# EAGLE design m365_esp32 (EAGLE 9.1.3)
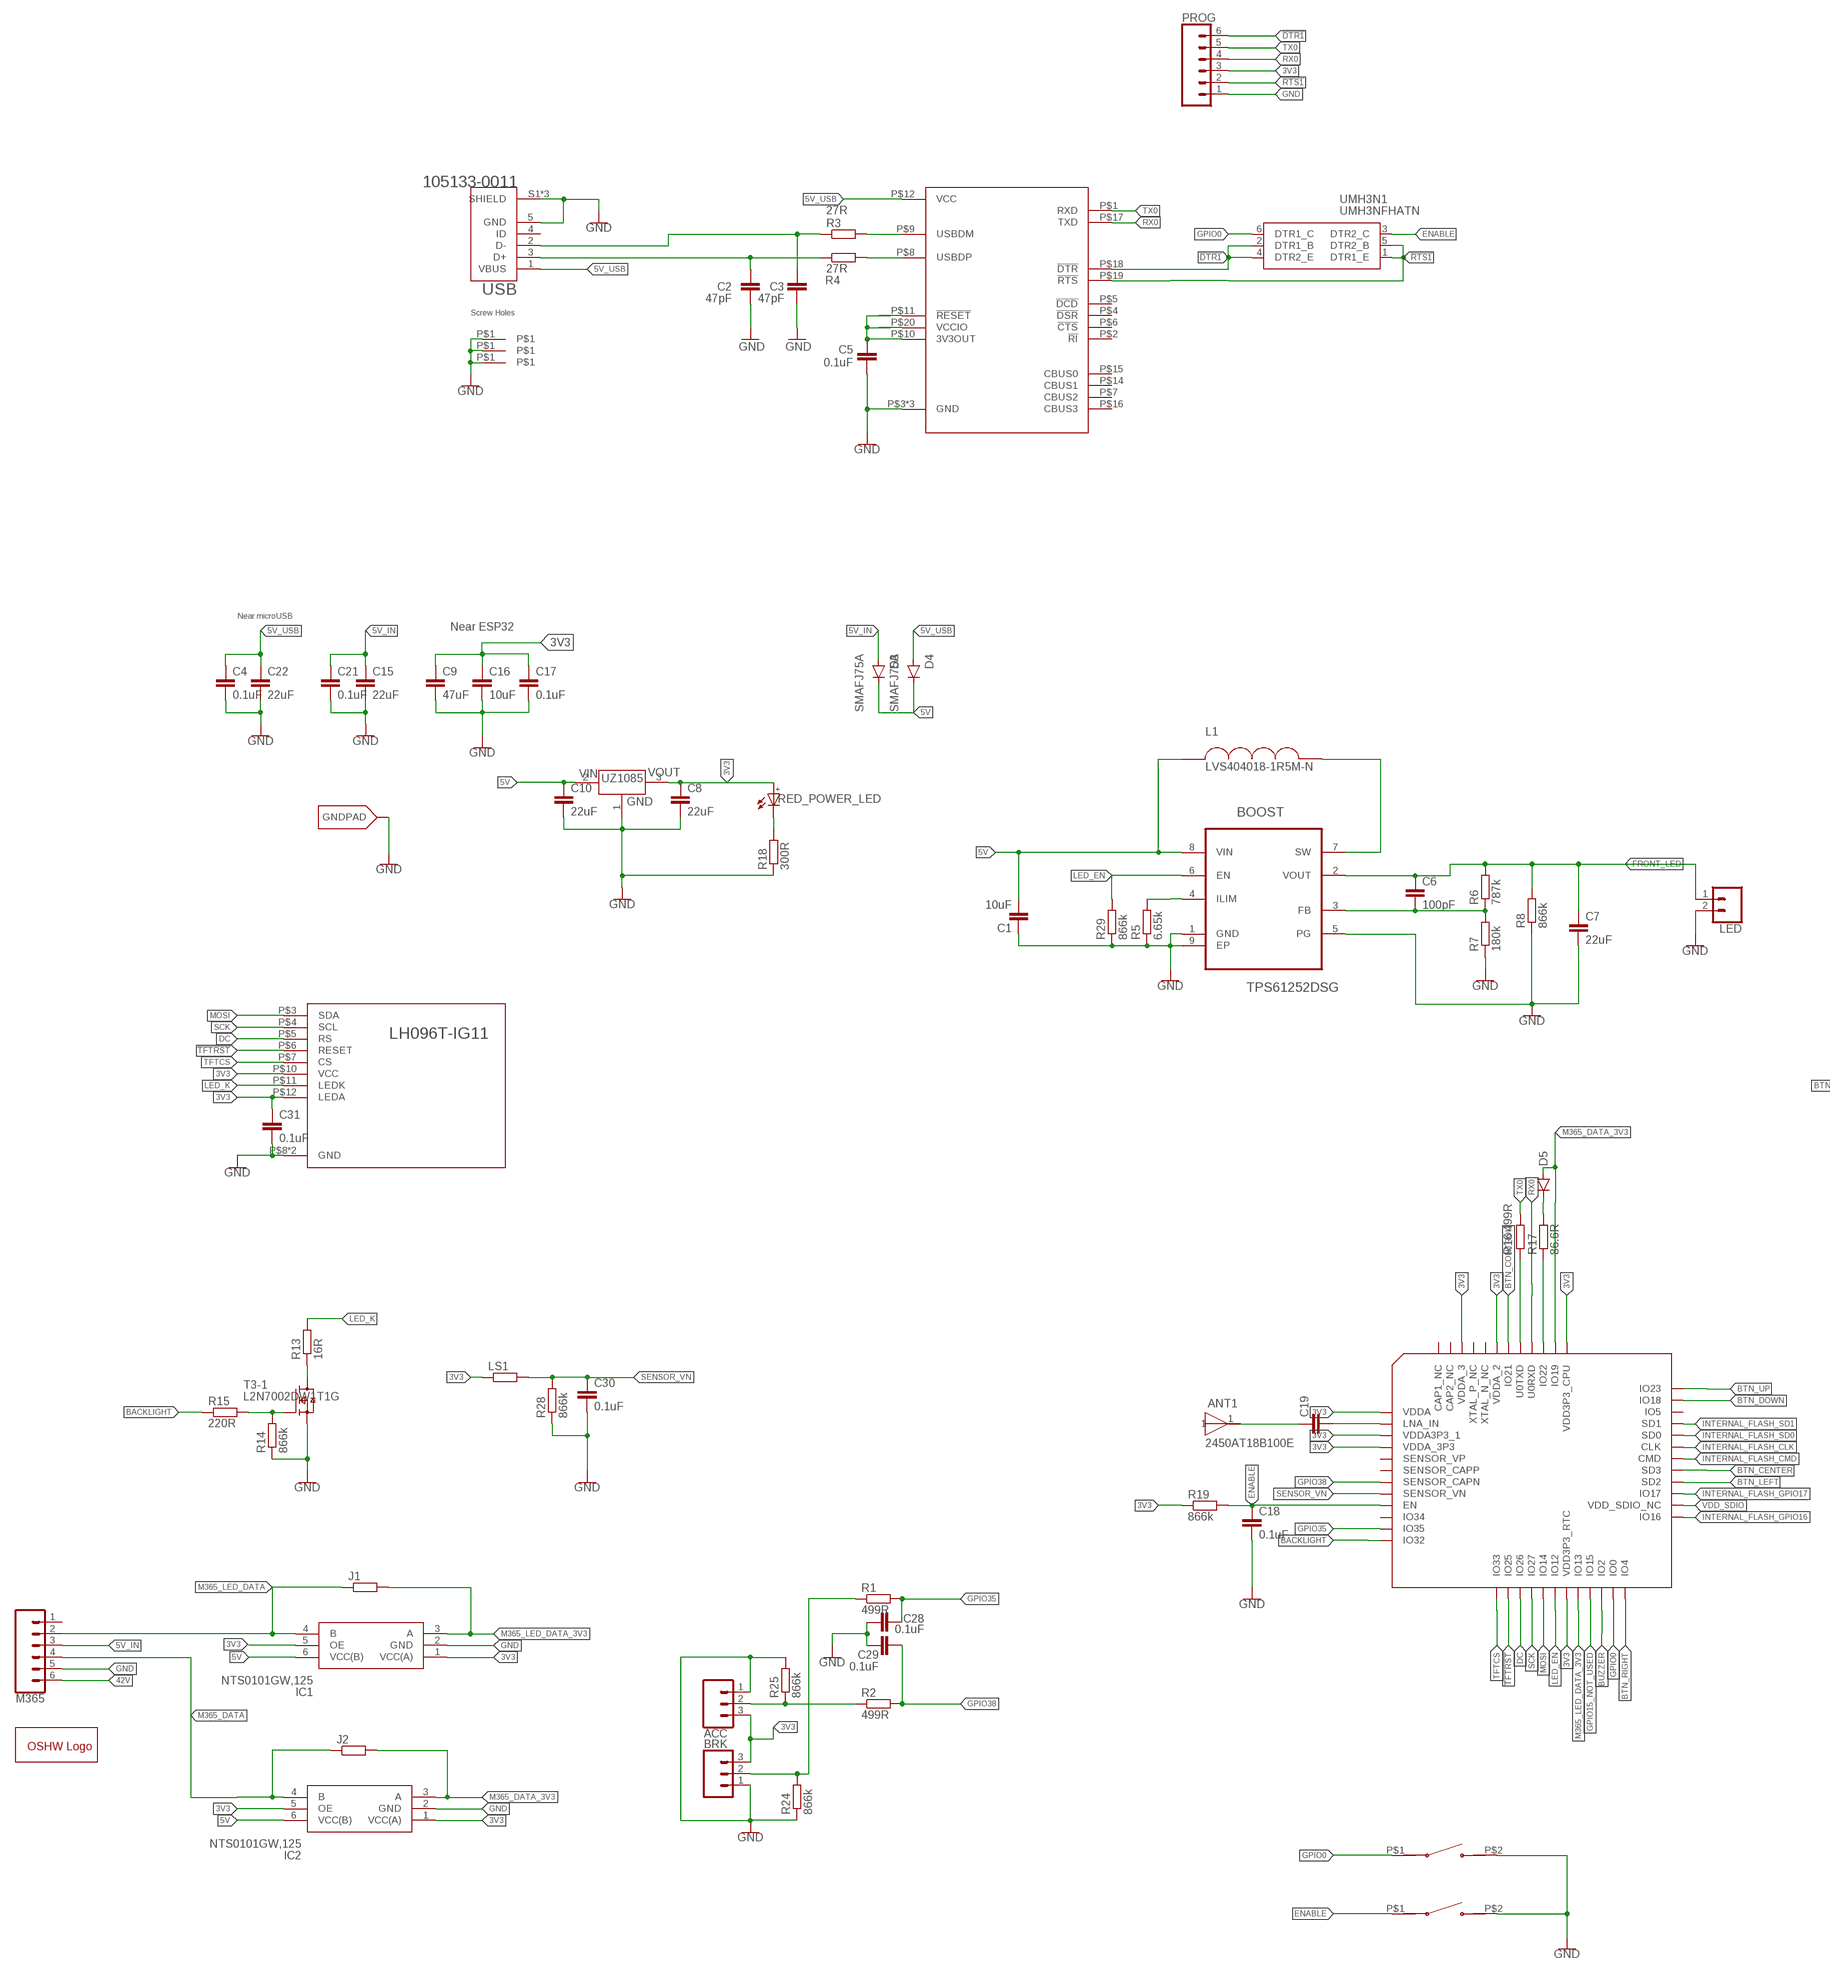
[diagram p0: schematic, sheet 1, part 1 of 2]
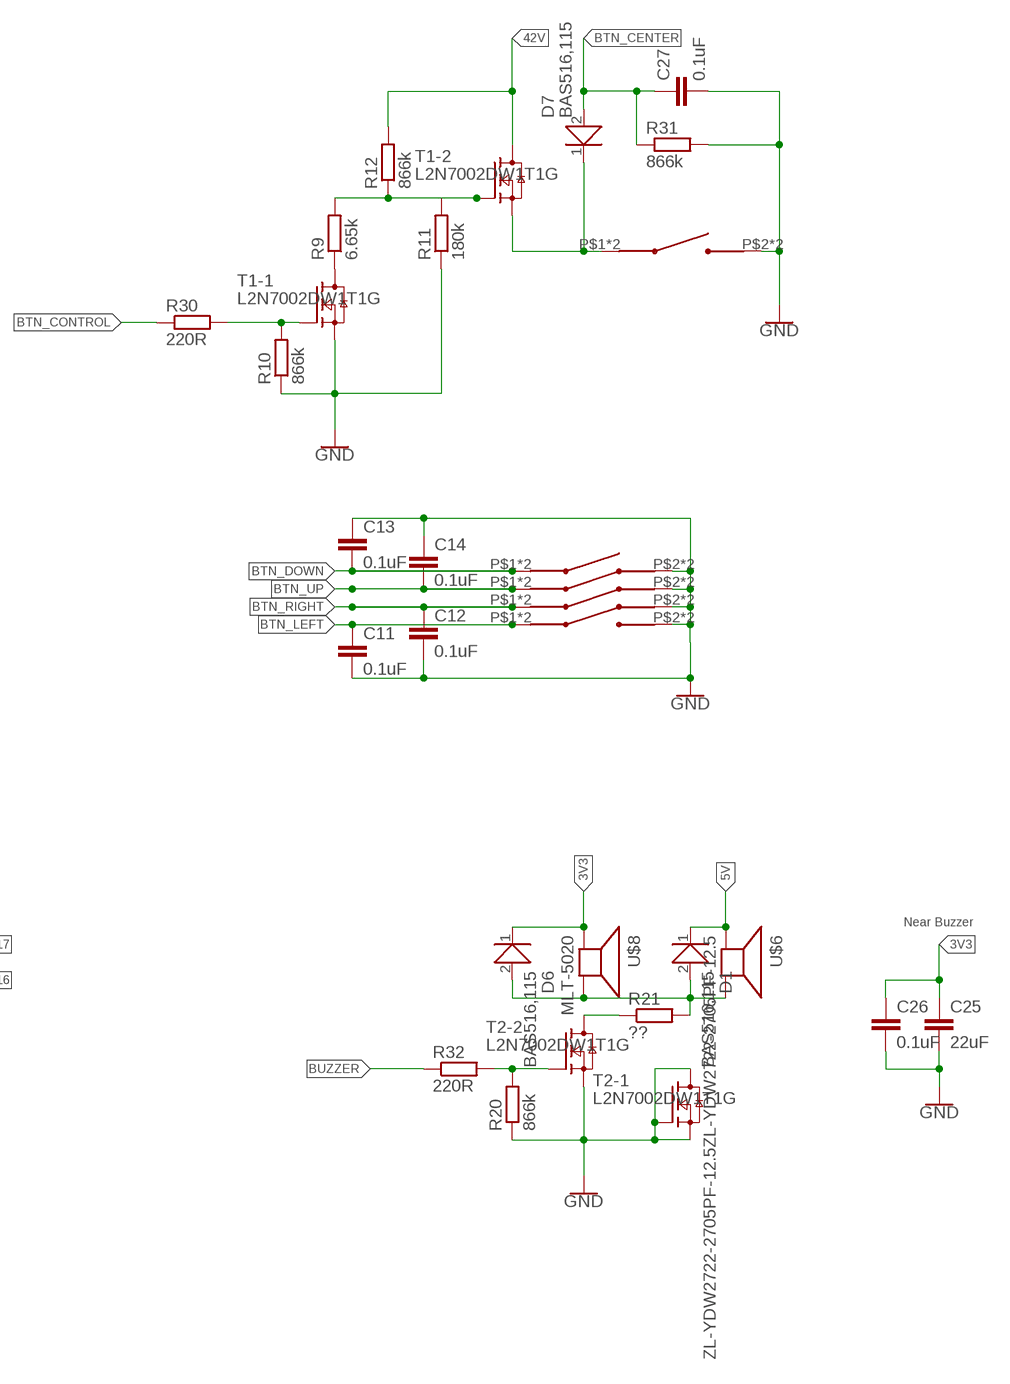
[diagram p1: schematic, sheet 1, part 2 of 2]

## Parts
ACC  CONN_03LONGPADS  [1X03_LONGPADS]
ANT1  2450AT18B100E  [ANT_2450AT18B100E]
BOOST  TPS61252DSG  [SON50P200X200X80-9N]
BRK  CONN_03LONGPADS  [1X03_LONGPADS]
C1  10uF  CC1206  [C1206]
C2  47pF  C-EUC0402  [C0402]
C3  47pF  C-EUC0402  [C0402]
C4  0.1uF  CC0402  [C0402]
C5  0.1uF  CC0402  [C0402]
C6  100pF  CC0603  [C0603]
C7  22uF  CC0603  [C0603]
C8  22uF  CC0603  [C0603]
C9  47uF  CC0603  [C0603]
C10  22uF  CC0603  [C0603]
C11  0.1uF  CC0402  [C0402]
C12  0.1uF  CC0402  [C0402]
C13  0.1uF  CC0402  [C0402]
C14  0.1uF  CC0402  [C0402]
C15  22uF  CC0603  [C0603]
C16  10uF  CC0402  [C0402]
C17  0.1uF  CC0402  [C0402]
C18  0.1uF  CC0402  [C0402]
C19  CC0402  [C0402]
C21  0.1uF  CC0402  [C0402]
C22  22uF  CC0603  [C0603]
C25  22uF  CC0603  [C0603]
C26  0.1uF  CC0402  [C0402]
C27  0.1uF  CC0402  [C0402]
C28  0.1uF  CC0402  [C0402]
C29  0.1uF  CC0402  [C0402]
C30  0.1uF  CC0402  [C0402]
C31  0.1uF  CC0402  [C0402]
CENTER  KSEK43J  [KSEK43J]
D1  BAS516,115  [SOD1608X65N]
D3  SMAFJ75A  [SMAFJ75A]
D4  SMAFJ75A  [SMAFJ75A]
D5  SMAFJ75A  [SMAFJ75A]
D6  BAS516,115  [SOD1608X65N]
D7  BAS516,115  [SOD1608X65N]
DOWN  KSEK43J  [KSEK43J]
FT231X  FT231XQ-R  [FT231XQ-R]
GOLD_ORB_SM2  OSHWLOGOLOGO5MM  [OSHW_5MM]
IC1  NTS0101GW,125  [SOT65P210X110-6N]
IC2  NTS0101GW,125  [SOT65P210X110-6N]
IC3  UNEXPECTEDMAKER_ESP32-PICO-D4  [UNEXPECTEDMAKER_PICO-D4-QFN48]
J1  RR0402  [R0402]
J2  RR0402  [R0402]
L1  LVS404018-1R5M-N  [LVS404018]
LED  CONN_02PTH3  [1X02_LONGPADS]
LEFT  KSEK43J  [KSEK43J]
LS1  RR1206  [R1206]
M365  CONN_06LONGPADS  [1X06_LONGPADS]
PROG  CONN_06LOCK  [1X06_LOCK]
R1  499R  RR0402  [R0402]
R2  499R  RR0402  [R0402]
R3  27R  R-EU_R0402  [R0402]
R4  27R  R-EU_R0402  [R0402]
R5  6.65k  RR0402  [R0402]
R6  787k  RR0603  [R0603]
R7  180k  RR0603  [R0603]
R8  866k  RR0402  [R0402]
R9  6.65k  RR0402  [R0402]
R10  866k  RR0402  [R0402]
R11  180k  RR0603  [R0603]
R12  866k  RR0402  [R0402]
R13  16R  RR0402  [R0402]
R14  866k  RR0402  [R0402]
R15  220R  RR0402  [R0402]
R16  499R  RR0402  [R0402]
R17  86.6R  RR0402  [R0402]
R18  300R  RR0402  [R0402]
R19  866k  RR0402  [R0402]
R20  866k  RR0402  [R0402]
R21  ??  R  [R0805]
R24  866k  RR0402  [R0402]
R25  866k  RR0402  [R0402]
R28  866k  RR0402  [R0402]
R29  866k  RR0402  [R0402]
R30  220R  RR0402  [R0402]
R31  866k  RR0402  [R0402]
R32  220R  RR0402  [R0402]
RED_POWER_LED  WL-SMCD_0603_150060BS55040  [WL-SMCD_0603]
REG  UZ1085L-33-TN3-R  [TO-252-2]
RIGHT  KSEK43J  [KSEK43J]
T1  L2N7002DW1T1G  2N7002PS  [SOT363]
T2  L2N7002DW1T1G  2N7002PS  [SOT363]
T3  L2N7002DW1T1G  2N7002PS  [SOT363]
U$1  TL3302BF260QJ  [TL3302BF260QJ]
U$2  TL3302BF260QJ  [TL3302BF260QJ]
U$3  SCREWHOLE-M2  [SCREWHOLE-M2]
U$4  SCREWHOLE-M2  [SCREWHOLE-M2]
U$5  SCREWHOLE-M2  [SCREWHOLE-M2]
U$6  ZL-YDW2722-2705PF-12.5ZL-YDW2722-2705PF-12.5  [ZL-YDW2722-2705PF-12.5]
U$8  MLT-5020  [MLT-5020]
U$11  LH096T-IG11  [LH096T-IG11]
UMH3N1  UMH3NFHATN  [SOT65P210X100-6N]
UP  KSEK43J  [KSEK43J]
USB  105133-0011  [MOLEX_105133-0011]

## Nets
3V3: ACC.3 BRK.3 C8.1 C9.1 C16.1 C17.1 C25.1 C26.1 C31.1 D6.1 IC1.1(VCC(A)) IC1.5(OE) IC2.1(VCC(A)) IC2.5(OE) IC3.1(VDDA) IC3.3(VDDA3P3_1) IC3.4(VDDA_3P3) IC3.19(VDD3P3_RTC) IC3.37(VDD3P3_CPU) IC3.43(VDDA_2) IC3.46(VDDA_3) LS1.1 PROG.3 R19.1 RED_POWER_LED.2(A) REG.3(VOUT) U$8.P$2(+) U$11.P$10(VCC) U$11.P$12(LEDA)
5V: BOOST.8(VIN) C1.2 C10.1 D1.1 D3.P$1(CATHODE) D4.P$1(CATHODE) IC1.6(VCC(B)) IC2.6(VCC(B)) L1.P$1 REG.2(VIN) U$6.P$1(+)
5V_IN: C15.1 C21.1 D3.P$2(ANODE) M365.3
5V_USB: C4.1 C22.1 D4.P$2(ANODE) FT231X.P$12(VCC) USB.1(VBUS)
42V: M365.6 R12.2 T1.3(-2:D)
!DTR1: FT231X.P$18(!DTR) PROG.6 UMH3N1.2(DTR1_B) UMH3N1.4(DTR2_E)
!RTS1: FT231X.P$19(!RTS) PROG.2 UMH3N1.1(DTR1_E) UMH3N1.5(DTR2_B)
!TFTRST: IC3.14(IO25) U$11.P$6(RESET)
A2: ACC.2 R2.1 R25.1
A5: BRK.2 R1.1 R24.2
BACKLIGHT: IC3.12(IO32) R15.1
BTN_CENTER: C27.1 D7.2 IC3.29(SD3) R31.1
BTN_CONTROL: IC3.42(IO21) R30.1
BTN_DOWN: C13.2 DOWN.P$1 DOWN.P$4 IC3.35(IO18)
BTN_LEFT: C11.1 IC3.28(SD2) LEFT.P$1 LEFT.P$4
BTN_RIGHT: C12.1 IC3.24(IO4) RIGHT.P$1 RIGHT.P$4
BTN_UP: C14.2 IC3.36(IO23) UP.P$1 UP.P$4
BUZZER: IC3.22(IO2) R32.1
DC: IC3.15(IO26) U$11.P$5(RS)
ENABLE: C18.1 IC3.9(EN) R19.2 U$2.P$1 UMH3N1.3(DTR2_C)
FRONT_LED: BOOST.2(VOUT) C6.1 C7.1 LED.1 R6.2 R8.2
GND: ACC.1 BOOST.1(GND) BOOST.5(PG) BOOST.9(EP) BRK.1 C1.1 C2.1 C3.1 C4.2 C5.2 C7.2 C8.2 C9.2 C10.2 C11.2 C12.2 C13.1 C14.1 C15.2 C16.2 C17.2 C18.2 C21.2 C22.2 C25.2 C26.2 C27.2 C28.1 C29.1 C30.2 C31.2 CENTER.P$2 CENTER.P$3 DOWN.P$2 DOWN.P$3 FT231X.P$3(GND) FT231X.P$13(GND) FT231X.P$21(GND) IC1.2(GND) IC2.2(GND) IC3.EXP(GNDPAD) LED.2 LEFT.P$2 LEFT.P$3 M365.5 PROG.1 R5.1 R7.1 R8.1 R10.1 R11.1 R14.1 R18.1 R20.1 R24.1 R25.2 R28.1 R29.1 R31.2 REG.1(GND) RIGHT.P$2 RIGHT.P$3 T1.1(-1:S) T2.1(-1:S) T2.2(-1:G) T2.4(-2:S) T2.6(-1:D) T3.1(-1:S) U$1.P$2 U$2.P$2 U$3.P$1 U$4.P$1 U$5.P$1 U$11.P$8(GND) U$11.P$13(GND) UP.P$2 UP.P$3 USB.5(GND) USB.S1(SHIELD) USB.S2(SHIELD) USB.S3(SHIELD)
GPIO0: IC3.23(IO0) U$1.P$1 UMH3N1.6(DTR1_C)
GPIO15_NOT_USED: IC3.21(IO15)
GPIO35: C28.2 IC3.11(IO35) R1.2
GPIO38: C29.2 IC3.7(SENSOR_CAPN) R2.2
INTERNAL_FLASH_CLK: IC3.31(CLK)
INTERNAL_FLASH_CMD: IC3.30(CMD)
INTERNAL_FLASH_GPIO16: IC3.25(IO16)
INTERNAL_FLASH_GPIO17: IC3.27(IO17)
INTERNAL_FLASH_SD0: IC3.32(SD0)
INTERNAL_FLASH_SD1: IC3.33(SD1)
LED_EN: BOOST.6(EN) IC3.18(IO12) R29.2
LED_K: R13.2 U$11.P$11(LEDK)
LNA_IN: C19.2 IC3.2(LNA_IN)
M365_DATA: IC2.4(B) J2.1 M365.4
M365_DATA_3V3: D5.P$2(ANODE) IC2.3(A) IC3.38(IO19) J2.2
M365_LED_DATA: IC1.4(B) J1.1 M365.2
M365_LED_DATA_3V3: IC1.3(A) IC3.20(IO13) J1.2
MOSI: IC3.17(IO14) U$11.P$3(SDA)
N$1: IC3.41(U0TXD) R16.1
N$2: ANT1.1 C19.1
N$3: R18.2 RED_POWER_LED.1(C)
N$4: CENTER.P$1 CENTER.P$4 D7.1 T1.4(-2:S)
N$5: R9.2 R11.2 R12.1 T1.5(-2:G)
N$6: C5.1 FT231X.P$10(3V3OUT) FT231X.P$11(!RESET) FT231X.P$20(VCCIO)
N$7: BOOST.7(SW) L1.P$2
N$8: BOOST.4(ILIM) R5.2
N$9: BOOST.3(FB) C6.2 R6.1 R7.2
N$10: R9.1 T1.6(-1:D)
N$11: D1.2 D6.2 R21.2 U$6.P$2(-) U$8.P$3(-)
N$12: R21.1 T2.3(-2:D)
N$13: R13.1 T3.6(-1:D)
N$14: R14.2 R15.2 T3.2(-1:G)
N$15: D5.P$1(CATHODE) R17.2
N$17: IC3.39(IO22) R17.1
N$28: R10.2 R30.2 T1.2(-1:G)
N$29: R20.2 R32.2 T2.5(-2:G)
RX0: FT231X.P$17(TXD) IC3.40(U0RXD) PROG.4
SCK: IC3.16(IO27) U$11.P$4(SCL)
SENSOR_VN: C30.1 IC3.8(SENSOR_VN) LS1.2 R28.2
TFTCS: IC3.13(IO33) U$11.P$7(CS)
TX0: FT231X.P$1(RXD) PROG.5 R16.2
USB-DATA_M: C3.2 R3.1 USB.2(D-)
USB-DATA_P: C2.2 R4.1 USB.3(D+)
USBDM: FT231X.P$9(USBDM) R3.2
USBDP: FT231X.P$8(USBDP) R4.2
VDD_SDIO: IC3.26(VDD_SDIO_NC)
Unconnected: FT231X.P$2(!RI) FT231X.P$4(!DSR) FT231X.P$5(!DCD) FT231X.P$6(!CTS) FT231X.P$7(CBUS2) FT231X.P$14(CBUS1) FT231X.P$15(CBUS0) FT231X.P$16(CBUS3) IC3.5(SENSOR_VP) IC3.6(SENSOR_CAPP) IC3.10(IO34) IC3.34(IO5) IC3.44(XTAL_N_NC) IC3.45(XTAL_P_NC) IC3.47(CAP2_NC) IC3.48(CAP1_NC) M365.1 T3.3(-2:D) T3.4(-2:S) T3.5(-2:G) USB.4(ID)

## Notes on the sheet
- Screw Holes
- Near microUSB
- Near ESP32
- Near Buzzer

## Library data of the parts
ACC BRK = SparkFun-Connectors:CONN_03: Multi connection point. Often used as Generic Header-pin footprint for 0.1 inch spaced/style header connections On any of the 0.1 inch spaced packages, you can populate with these: Break Away Headers - Straight <https://www.sparkfun.com/products/116> (PRT-00116) Break Away Male Headers - Right Angle <https://www.sparkfun.com/products/553> (PRT-00553) Female Headers <https://www.sparkfun.com/products/115> (PRT-00115) Break Away Headers - Machine Pin <https://www.sparkfun.com/products/117> (PRT-00117) Break Away Female Headers - Swiss Machine Pin <https://www.sparkfun.com/products/743> (PRT-00743) Stackable Header - 3 Pin (Female, 0.1") <https://www.sparkfun.com/products/13875> (PRT-13875) For SCREWTERMINALS and SPRING TERMINALS visit here: Screw Terimnals on SparkFun.com <https://www.sparkfun.com/search/results?term=Screw+Terminals> (5mm/3.5mm/2.54mm spacing) This device is also useful as a general connection point to wire up your design to another part of your project. Our various solder wires solder well into these plated through hole pads. Hook-Up Wire - Assortment (Stranded, 22 AWG) <https://www.sparkfun.com/products/11375> (PRT-11375) Hook-Up Wire - Assortment (Solid Core, 22 AWG) <https://www.sparkfun.com/products/11367> (PRT-11367) View the entire wire category on our website here <https://www.sparkfun.com/categories/141> Special notes: Molex polarized connector foot print use with SKU : PRT-08232 with associated crimp pins and housings.
ANT1 = 2450AT18B100E:2450AT18B100E: ANTENNA, CERAMIC, 2.45GHZ; Bandwidth: 100MHz; Frequency: 2.45GHz; Gain: -0.5dB; Impedance: 50ohm http://www.snapeda.com/parts/2450AT18B100E/Johanson/view-part/#; AVAILABILITY: Unavailable; DESCRIPTION: ANTENNA, CERAMIC, 2.45GHZ; Bandwidth: 100MHz; Frequency: 2.45GHz; Gain: -0.5dB; Impedance: 50ohm; MF: Johanson Technology; MP: 2450AT18B100E; PACKAGE: None; PRICE: None
BOOST = TPS61252DSG:TPS61252DSG: TINY 1.5-A BOOST CONVERTER WITH ADJUSTABLE INPUT CURRENT LIMIT; AVAILABILITY: Unavailable; DESCRIPTION: 3.5MHz, 1.5A, 92% Efficient Boost Converter with Adjustable Input Current Limit 8-WSON -40 to 85; MF: Texas Instruments; MP: TPS61252DSG; PACKAGE: None; PRICE: None
C1 C4-C19 C21 C22 C25-C31 = eagle-ltspice:C: CAPACITOR, European symbol; SPICEMODEL: NONE; SPICEPREFIX: C
C2 C3 = resistor:C-EU: CAPACITOR, European symbol
CENTER DOWN LEFT RIGHT UP = my-lib:KSEK43J
D1 D6 D7 = BAS516_115:BAS516,115: NXP - BAS516,115 - DIODE, SWITCHING, 150MA, 100V, SOD-523 Source: Datasheet <http://www.mouser.com/ds/2/302/BAS16_SER-839896.pdf>; DESCRIPTION: NXP - BAS516,115 - DIODE, SWITCHING, 150MA, 100V, SOD-523; HEIGHT: 0.65mm; MANUFACTURER_NAME: Nexperia; MANUFACTURER_PART_NUMBER: BAS516,115; MOUSER_PART_NUMBER: 771-BAS516-T/R; MOUSER_PRICE-STOCK: https://www.mouser.com/Search/Refine.aspx?Keyword=771-BAS516-T%2FR; RS_PART_NUMBER: 0508282; RS_PRICE-STOCK: http://uk.rs-online.com/web/p/products/0508282
D3-D5 = my-lib:SMAFJ75A
FT231X = FT231XQ-R:FT231XQ-R
GOLD_ORB_SM2 = oshw:OSHWLOGO: The OSHW logo for PCB layout
IC1 IC2 = NTS0101GW_125:NTS0101GW,125: NXP - NTS0101GW,125 - TRANSCEIVER, BIDIR TRANSLATOR, SC-88-6 Source: Datasheet <https://www.nxp.com/docs/en/data-sheet/NTS0101.pdf>; DESCRIPTION: NXP - NTS0101GW,125 - TRANSCEIVER, BIDIR TRANSLATOR, SC-88-6; HEIGHT: 1.1mm; MANUFACTURER_NAME: Nexperia; MANUFACTURER_PART_NUMBER: NTS0101GW,125; MOUSER_PART_NUMBER: 771-NTS0101GW125; MOUSER_PRICE-STOCK: https://www.mouser.com/Search/Refine.aspx?Keyword=771-NTS0101GW125
IC3 = m365_esp32:UNEXPECTEDMAKER_ESP32-PICO-D4
J1 J2 LS1 R1 R2 R5-R21 R24 R25 R28-R32 = eagle-ltspice:R: RESISTOR, European symbol; SPICEMODEL: NONE; SPICEPREFIX: R
L1 = my-lib:LVS404018-1R5M-N
LED = SparkFun-Connectors:CONN_02: Multi connection point. Often used as Generic Header-pin footprint for 0.1 inch spaced/style header connections On any of the 0.1 inch spaced packages, you can populate with these: Break Away Headers - Straight <https://www.sparkfun.com/products/116> (PRT-00116) Break Away Male Headers - Right Angle <https://www.sparkfun.com/products/553> (PRT-00553) Female Headers <https://www.sparkfun.com/products/115> (PRT-00115) Break Away Headers - Machine Pin <https://www.sparkfun.com/products/117> (PRT-00117) Break Away Female Headers - Swiss Machine Pin <https://www.sparkfun.com/products/743> (PRT-00743) For SCREWTERMINALS and SPRING TERMINALS visit here: Screw Terimnals on SparkFun.com <https://www.sparkfun.com/search/results?term=Screw+Terminals> (5mm/3.5mm/2.54mm spacing) This device is also useful as a general connection point to wire up your design to another part of your project. Our various solder wires solder well into these plated through hole pads. Hook-Up Wire - Assortment (Stranded, 22 AWG) <https://www.sparkfun.com/products/11375> (PRT-11375) Hook-Up Wire - Assortment (Solid Core, 22 AWG) <https://www.sparkfun.com/products/11367> (PRT-11367) View the entire wire category on our website here <https://www.sparkfun.com/categories/141> Special notes: Molex polarized connector foot print use with: PRT-08233 with associated crimp pins and housings. 2.54_SCREWTERM for use with PRT-10571. 3.5mm Screw Terminal footprints for PRT-08084 5mm Screw Terminal footprints for use with PRT-08432
M365 PROG = SparkFun-Connectors:CONN_06: Multi connection point. Often used as Generic Header-pin footprint for 0.1 inch spaced/style header connections On any of the 0.1 inch spaced packages, you can populate with these: Break Away Headers - Straight <https://www.sparkfun.com/products/116> (PRT-00116) Break Away Male Headers - Right Angle <https://www.sparkfun.com/products/553> (PRT-00553) Female Headers <https://www.sparkfun.com/products/115> (PRT-00115) Break Away Headers - Machine Pin <https://www.sparkfun.com/products/117> (PRT-00117) Break Away Female Headers - Swiss Machine Pin <https://www.sparkfun.com/products/743> (PRT-00743) Arduino Stackable Header - 6 Pin <https://www.sparkfun.com/products/9280> (PRT-09280) For SCREWTERMINALS and SPRING TERMINALS visit here: Screw Terimnals on SparkFun.com <https://www.sparkfun.com/search/results?term=Screw+Terminals> (5mm/3.5mm/2.54mm spacing) This device is also useful as a general connection point to wire up your design to another part of your project. Our various solder wires solder well into these plated through hole pads. Hook-Up Wire - Assortment (Stranded, 22 AWG) <https://www.sparkfun.com/products/11375> (PRT-11375) Hook-Up Wire - Assortment (Solid Core, 22 AWG) <https://www.sparkfun.com/products/11367> (PRT-11367) View the entire wire category on our website here <https://www.sparkfun.com/categories/141>
R3 R4 = resistor:R-EU_: RESISTOR, European symbol
RED_POWER_LED = Wurth_Elektronik_Optoelectronics_rev18a:WL-SMCD_0603: WL-SMCD SMD Mono-color Chip LED Diffused Characteristics Industrial 0603 platform – 1.6 x 0.8 mm Wide viewing angle 140° Thin version: 0.4 mm Applications Office Automation Home appliances Industrial equipment Front panel backlighting Button backlighting LCD backlighting Navigation backlighting <http://katalog.we-online.de/media/images/v2/Family_WL-SMCD_0603_thin_0,4mm_150060xx55040.jpg> Details see: http://katalog.we-online.de/en/led/WL-SMCD?m Created By Yingchun Shan 2018-03-09 2018 (C) Wurth Elektronik
REG = my-lib:UZ1085L-33-TN3-R
T1-T3 = nxp_60_1_1:2N7002P: 60 V, 320 mA N-channel Trench MOSFET Dual N-channel enhancement mode Field-Effect Transistor (FET) in a very small SOT363 (SC-88) Surface-Mounted Device (SMD) plastic package using Trench MOSFET technology. AAL Eindhoven MK
U$1 U$2 = my-lib:TL3302BF260QJ
U$3-U$5 = my-lib:SCREWHOLE-M2
U$6 = my-lib:ZL-YDW2722-2705PF-12.5
U$8 = my-lib:MLT-5020
U$11 = my-lib:LH096T-IG11
UMH3N1 = UMH3NFHATN:UMH3NFHATN: ROHM - UMH3NFHATN - TRANS, NPN, AUTO, 4.7K/4.7K, SOT-353 Source: Datasheet <http://www.rohm.com/web/global/datasheet/UMH3NFHA/umh3nfha-e>; DESCRIPTION: ROHM - UMH3NFHATN - TRANS, NPN, AUTO, 4.7K/4.7K, SOT-353; HEIGHT: 1mm; MANUFACTURER_NAME: ROHM Semiconductor; MANUFACTURER_PART_NUMBER: UMH3NFHATN; MOUSER_PART_NUMBER: 755-UMH3NFHATN; MOUSER_PRICE-STOCK: https://www.mouser.com/Search/Refine.aspx?Keyword=755-UMH3NFHATN
USB = 105133-0011:105133-0011: Conn Micro USB Type B RCP 5 POS 0.65mm Solder ST SMD 5 Terminal 1 Port Embossed T/R; AVAILABILITY: Unavailable; DESCRIPTION: Conn Micro USB Type B RCP 5 POS 0.65mm Solder ST SMD 5 Terminal 1 Port Embossed T/R; MF: Molex; MP: 105133-0011; PACKAGE: None; PRICE: None

## Board
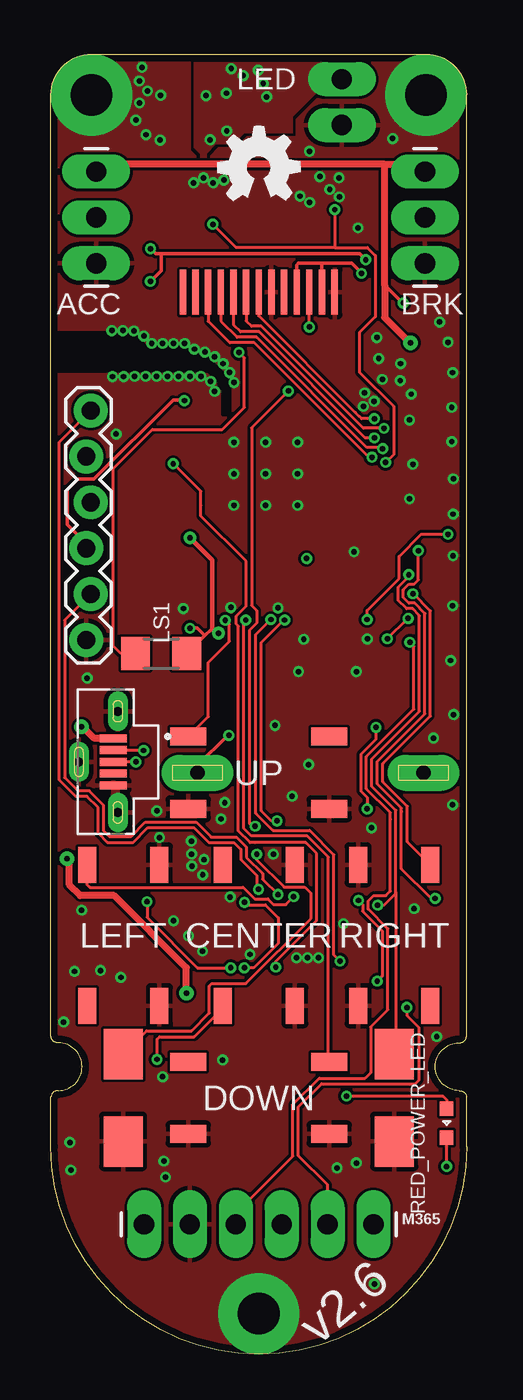
[diagram p2: board, top side]
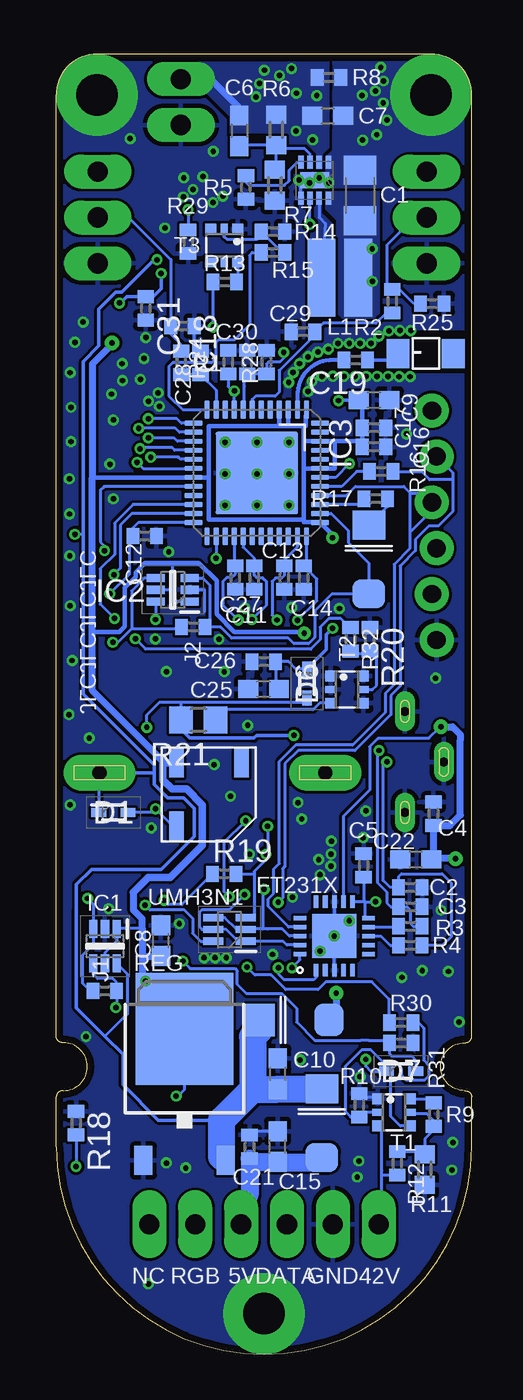
[diagram p3: board, bottom side, seen from below]

Size 23 x 71.98 mm. Coordinates in mm from the lower left corner, seen from the top.
Outline: 23,11.5 arc-180 0,11.5 0,14.25 arc-90 0.4,14.6 arc180 0.4,17.25 arc-90 0,17.6 0,69.73 arc-90 2.25,71.98 20.75,71.98 arc-90 23,69.73 23,17.6 arc-90 22.6,17.25 arc180 22.6,14.6 arc-90 23,14.25 23,11.5
Copper layers (1*16): Top 0.035559375mm / dielectric 1.6mm / Bottom 0.035559375mm
Design rules "oshpark-2layer": minimum track width 6mil, minimum drill 10mil, track to track 6mil, track to pad 6mil, pad to pad 6mil, via to via 6mil, smd to smd 6mil, copper to edge 15mil, drill to drill 6mil, minimum pad ring 5mil, minimum via ring 5mil, stop-mask expansion 2.5mil, vias tented up to drill 0mil, thermal gap 10mil

### Footprints (pad centres in the part's own frame; a part is rotated, then mirrored left to right if it is on the bottom)
1X03_LONGPADS = drill 1.118 pad 1.88 long: 1 0,0; 2 2.54,0; 3 5.08,0
ANT_2450AT18B100E = smd 1.27 x 1.6: 1 -1.535,0; 2 1.535,0
SON50P200X200X80-9N = smd 0.711 x 0.305: 1 -0.991,0.762; 2 -0.991,0.254; 3 -0.991,-0.254; 4 -0.991,-0.762; 5 0.991,-0.762; 6 0.991,-0.254; 7 0.991,0.254; 8 0.991,0.762 | smd 0.889 x 1.6: 9 0,0
C1206 = smd 1.6 x 1.8: 1 -1.4,0; 2 1.4,0
C0402 = smd 0.7 x 0.9: 1 -0.65,0; 2 0.65,0
C0603 = smd 1.1 x 1: 1 -0.85,0; 2 0.85,0
KSEK43J = smd 2 x 1: P$1 3.9,2; P$2 3.9,-2; P$3 -3.9,-2; P$4 -3.9,2
SOD1608X65N = smd 0.818 x 0.5: 1 -0.808,0; 2 0.808,0
SMAFJ75A = smd 1.6 x 1.8: P$1 1.9,0; P$2 -1.9,0
FT231XQ-R = smd 0.7 x 0.25: P$1 -1.9,1; P$2 -1.9,0.5; P$3 -1.9,0; P$4 -1.9,-0.5; P$5 -1.9,-1; P$11 1.9,-1; P$12 1.9,-0.5; P$13 1.9,0; P$14 1.9,0.5; P$15 1.9,1 | smd 0.25 x 0.7: P$6 -1,-1.9; P$7 -0.5,-1.9; P$8 0,-1.9; P$9 0.5,-1.9; P$10 1,-1.9; P$16 1,1.9; P$17 0.5,1.9; P$18 0,1.9; P$19 -0.5,1.9; P$20 -1,1.9 | smd 2.45 x 2.45: P$21 0,0
SOT65P210X110-6N = smd 1 x 0.45: 1 -0.95,0.65; 2 -0.95,0; 3 -0.95,-0.65; 4 0.95,-0.65; 5 0.95,0; 6 0.95,0.65
UNEXPECTEDMAKER_PICO-D4-QFN48 = smd 1.016 x 0.3: 1 -3.505,2.75; 2 -3.505,2.25; 3 -3.505,1.75; 4 -3.505,1.25; 5 -3.505,0.75; 6 -3.505,0.25; 7 -3.505,-0.25; 8 -3.505,-0.75; 9 -3.505,-1.25; 10 -3.505,-1.75; 11 -3.505,-2.25; 12 -3.505,-2.75; 25 3.505,-2.75; 26 3.505,-2.25; 27 3.505,-1.75; 28 3.505,-1.25; 29 3.505,-0.75; 30 3.505,-0.25; 31 3.505,0.25; 32 3.505,0.75; 33 3.505,1.25; 34 3.505,1.75; 35 3.505,2.25; 36 3.505,2.75 | smd 0.3 x 1.016: 13 -2.75,-3.505; 14 -2.25,-3.505; 15 -1.75,-3.505; 16 -1.25,-3.505; 17 -0.75,-3.505; 18 -0.25,-3.505; 19 0.25,-3.505; 20 0.75,-3.505; 21 1.25,-3.505; 22 1.75,-3.505; 23 2.25,-3.505; 24 2.75,-3.505; 37 2.75,3.505; 38 2.25,3.505; 39 1.75,3.505; 40 1.25,3.505; 41 0.75,3.505; 42 0.25,3.505; 43 -0.25,3.505; 44 -0.75,3.505; 45 -1.25,3.505; 46 -1.75,3.505; 47 -2.25,3.505; 48 -2.75,3.505 | smd 4.572 x 4.572: EXP 0,0
R0402 = smd 0.7 x 0.9: 1 -0.65,0; 2 0.65,0
LVS404018 = smd 4.318 x 1.524: P$1 0,1.016; P$2 0,-1.016
1X02_LONGPADS = drill 1.118 pad 1.88 long: 1 0,0; 2 2.54,0
R1206 = smd 1.6 x 1.803: 1 -1.422,0; 2 1.422,0
1X06_LONGPADS = drill 1.118 pad 1.88 long: 1 0,0; 2 2.54,0; 3 5.08,0; 4 7.62,0; 5 10.16,0; 6 12.7,0
1X06_LOCK = drill 1.016 pad 1.88: 1 0,0; 2 2.54,-0.254; 3 5.08,0; 4 7.62,-0.254; 5 10.16,0; 6 12.7,-0.254
R0603 = smd 1 x 1.1: 1 -0.85,0; 2 0.85,0
R0805 = smd 1.3 x 1.5: 1 -0.95,0; 2 0.95,0
WL-SMCD_0603 = smd 0.8 x 0.75: 1 -0.8,0; 2 0.8,0
TO-252-2 = smd 1 x 1.6: 1 -2.28,-6.07; 2 2.28,-6.07 | smd 5.4 x 6.2: 3 0,1.23
SOT363 = smd 0.6 x 0.6: 1 -0.75,-0.9; 3 0.75,-0.9; 4 0.75,0.9; 6 -0.75,0.9 | smd 0.4 x 0.6: 2 0,-0.9; 5 0,0.9
TL3302BF260QJ = smd 2.795 x 2.16: P$1 -2.413,0; P$2 2.413,0
SCREWHOLE-M2 = drill 2.3 pad 4.5: P$1 0,0
ZL-YDW2722-2705PF-12.5 = drill 0.8 pad 2 long: P$1 -6.25,0; P$2 6.25,0
MLT-5020 = smd 0.8 x 1.6: P$1 -1.8,-1.75; P$2 1.8,-1.75; P$3 1.8,1.75
LH096T-IG11 = smd 0.35 x 2.5: P$1 -4.2,0; P$2 -3.5,0; P$3 -2.8,0; P$4 -2.1,0; P$5 -1.4,0; P$6 -0.7,0; P$7 0,0; P$8 0.7,0; P$9 1.4,0; P$10 2.1,0; P$11 2.8,0; P$12 3.5,0; P$13 4.2,0
SOT65P210X100-6N = smd 1.1 x 0.4: 1 -0.9,0.65; 2 -0.9,0; 3 -0.9,-0.65; 4 0.9,-0.65; 5 0.9,0; 6 0.9,0.65
MOLEX_105133-0011 = smd 0.45 x 1.5: 1 -1.3,-0.25; 2 -0.65,-0.25; 3 0,-0.25; 4 0.65,-0.25; 5 1.3,-0.25 | drill 0.5 pad 1.1 long: S1 -2.8,0; S2 2.8,0; S3 0,-2.15

### Placement (x,y rotation side)
ACC  2.5,60.4 90 top
ANT1  2.55,55.4 0 bottom
BOOST  8.7,65 270 bottom
BRK  20.7,60.4 90 top
C1  6.19,64.16 270 bottom
C2  3.4,25.85 180 bottom
C3  3.4,24.78 180 bottom
C4  2.12,29.93 90 bottom
C5  5.99,27.07 90 bottom
C6  12.87,67.74 270 bottom
C7  7.97,68.57 0 bottom
C8  17.2,22.9 90 bottom
C9  5.41,52.83 0 bottom
C10  10.73,15.53 90 bottom
C11  13.1,43 270 bottom
C12  18.1,45.3 0 bottom
C13  10.38,43 90 bottom
C14  9.3,43 90 bottom
C15  10.75,11.5 90 bottom
C16  5.41,50.24 0 bottom
C17  5.41,51.3 0 bottom
C18  13.48,54.93 90 bottom
C19  6.43,55.05 180 bottom
C21  12.3,11.49 90 bottom
C22  3.1,27.4 180 bottom
C25  11.52,36.83 180 bottom
C26  11.51,38.35 180 bottom
C27  12.04,43 270 bottom
C28  15.02,54.89 270 bottom
C29  9.34,56.61 0 bottom
C30  12.42,54.93 90 bottom
C31  18.04,57.91 270 bottom
CENTER  11.5,23.2 90 top
D1  19.83,30 0 bottom
D3  8.3,12.8 90 bottom
D4  9.81,18.51 180 bottom
D5  5.7,44 90 bottom
D6  9.12,37.14 270 bottom
D7  3.91,15.68 0 bottom
DOWN  11.5,14.2 0 top
FT231X  7.61,23.16 90 bottom
GOLD_ORB_SM2  11.5,65.7 0 top
IC1  20.3,22.6 270 bottom
IC2  16.55,42.33 180 bottom
IC3  11.9,48.8 270 bottom
J1  20.31,20.12 180 bottom
J2  15.41,40.27 0 bottom
L1  7.3,59.6 270 bottom
LED  16.1,70.6 270 top
LEFT  4,23.2 90 top
LS1  6.1,38.8 180 top
M365  17.85,7.2 180 top
PROG  1.95,39.55 90 top
R1  16.08,54.89 270 bottom
R2  4.4,58.3 270 bottom
R3  3.4,23.7 180 bottom
R4  3.4,22.64 180 bottom
R5  12.5,64.6 90 bottom
R6  10.82,67.79 90 bottom
R7  10.9,64.73 90 bottom
R8  7.9,70.69 180 bottom
R9  2.1,13.27 270 bottom
R10  6.23,13.79 270 bottom
R11  2.6,10.23 90 bottom
R12  4.12,10.57 270 bottom
R13  13.68,59.37 180 bottom
R14  11,62.15 180 bottom
R15  11,61 0 bottom
R16  5.01,48.88 0 bottom
R17  5.32,47.37 0 bottom
R18  21.9,12.8 270 bottom
R19  13.7,26.6 0 bottom
R20  5.64,39.59 270 bottom
R21  15.13,35.12 180 bottom
R24  16.01,56.93 180 bottom
R25  2.19,58.17 0 bottom
R28  11.36,54.94 270 bottom
R29  15.7,61.6 90 bottom
R30  3.91,18.37 0 bottom
R31  3.9,17.24 0 bottom
R32  6.71,39.59 270 bottom
RED_POWER_LED  21.9,12.8 90 top
REG  15.9,16.8 0 bottom
RIGHT  19,23.2 270 top
T1  4.3,13.4 270 bottom
T2  6.9,36.8 270 bottom
T3  13.7,61.4 180 bottom
U$1  19,14.2 270 top
U$2  4,14.2 270 top
U$3  11.5,2.25 0 top
U$4  20.75,69.73 0 top
U$5  2.25,69.73 0 top
U$6  14.36,32.19 180 top
U$8  14.55,31 180 bottom
U$11  11.5,58.8 0 top
UMH3N1  13.41,23.52 180 bottom
UP  11.5,32.2 0 top
USB  3.7,32.8 270 top

### Tracks (layer width: path | path; a pad name or v marks a point on that pad's centre or on a via)
3V3  (via drill 0.3 pad 0.6, 0.3 pad 0.7, 0.3 pad 0.8)
  Top 0.152: 19.47,58.2 v19.5,58.2 | RED_POWER_LED.2 21.9,14.1 21.7,14.3 v16.36,14.3 | LS1.1 7.52,38.82 | 9.01,40.14 8.93,40.14 8.86,40.14 | v17.02,25.13 17.25,24.91 17.25,24.52 18.34,23.43 18.34,20.94 v18.06,20.66
  Top 0.2: U$11.P$10 13.6,60.3 13.7,60.4 15.01,60.4 | 15.01,60.4 16.64,60.4 v17.19,59.85 | U$11.P$12 15,60.39 15.01,60.4 | 18.47,59.2 19.47,58.2 | PROG.3 1.95,44.89 0.9,45.94 0.9,47.87 1.48,48.45 2.37,48.45 6.76,52.83 7.35,52.83 v7.38,52.8 | LS1.1 8.51,39.79 | 8.51,39.79 8.86,40.14 | v7.7,40.2 8.1,40.2 8.51,39.79
  Top 0.25: 9.01,40.14 9.22,39.93 v9.27,39.93 | 8.93,40.14 8.93,43.97 v7.7,45.2
  Top 0.4: ACC.3 2.9,65.88 18.47,65.88 | BRK.3 20.3,65.88 18.47,65.88 | 18.47,65.88 18.47,59.2 18.47,57.4 19.87,56 v19.9,56
  Bottom 0.152: REG.3 15.61,18.03 14,19.64 | 16.59,17.09 16.59,16.88 18.38,15.09 | REG.3 16.9,18.03 | IC1.5 20.3,22.23 19.66,22.88 19.66,23.3 19.65,23.31 IC1.1 19.6,23.6 18.25,23.6 | 10.72,39.98 10.7,40 | IC2.1 16.55,41.68 16.55,42.33 | 16.55,42.33 16.55,43.8 | IC2.5 16.55,42.33 | C25.1 10.86,37.02 C26.1 10.14,38.35 9.74,37.95 D6.1 | R19.1 16.05,24.91 16.8,24.91 v17.02,25.13 | REG.3 15.9,18.5 v18.06,20.66 | v16.36,14.3 16.25,14.3 15.9,14.65 REG.3
  Bottom 0.2: v17.19,59.85 17.19,58.99 17.62,58.56 C31.1 19.1,58.56 19.46,58.2 v19.5,58.2 | v7.38,52.8 7.35,52.83 C9.1 | D6.1 8.06,39.01 8.06,39.84 v7.7,40.2
  Bottom 0.25: 10.72,40 9.34,40 v9.27,39.93 | 10.7,40 13.14,40 14.13,40.99 14.13,42.83 15.1,43.8 16.55,43.8 18.1,43.8 18.61,43.29 18.61,43.03 19.19,42.45 19.19,40.31 19.5,40 21,40 | 21,48.55 IC3.19 14.56,48.55 | IC3.4 10.65,51.4 | IC3.1 9.15,51.98 9.18,51.98 9.18,51.4 9.3,51.4 | 10.65,51.4 10.15,51.4 | 10.15,51.4 9.3,51.4 | IC3.3 10.15,51.4 | 9.3,50.55 IC3.46 7.59,50.55 | 9.3,50.55 9.3,51.4 | 9.29,49.05 9.3,49.05 9.3,50.55 | 9.29,46.21 9.29,46.08 8.43,46.08 IC3.37 7.7,45.35 v7.7,45.2 | 9.29,46.21 9.29,49.05 | 10.65,51.4 14.56,51.4 14.56,48.55 | C9.1 6.06,52.83 C17.1 C16.1 6.06,50.55 7.59,50.55 | 7.59,50.55 7.59,49.05 IC3.43 9.29,49.05 | 9.29,46.21 14.56,46.21 14.56,48.55
  Bottom 0.4: 16.9,18.03 17.7,18.03 | 17.7,18.03 18.35,18.03 | 17.3,16.38 16.59,17.09 15.9,17.78 REG.3 17.07,19.2 17.1,19.2 18.25,20.35 18.25,22 | 18.05,18.38 17.7,18.03 | v19.9,56 19.9,55.93 21,54.83 21,48.55 21,40 21,36.74 17.31,33.05 | 18.25,22 18.25,23.6 18.25,24.12 18.73,24.6 18.73,25.57 | C8.1 17.25,22 18.25,22
  Bottom 0.406: 18.73,25.57 17.9,26.4 16.7,26.4 14.92,28.18 14.92,30.42 15.79,31.29 16.59,31.29 17.1,31.8 17.1,32.84 | 17.31,33.05 17.1,32.84 | U$8.P$2 17.01,32.75 17.1,32.84
5V  (via drill 0.3 pad 0.6)
  Top 0.152: v17.5,40.68 17.5,41.19 19.27,42.96 19.27,44.18 20.49,45.4 v21.97,45.4
  Top 0.2: v17.42,60.6 17.09,60.93 6.1,60.93 | 6.1,60.93 5.79,60.93 v5.51,61.21 | 6.1,60.93 6.1,60 v5.5,59.4
  Bottom 0.152: IC1.6 19.06,21.06 19.06,18.84 20.3,17.6 | 21.88,24.68 21.88,24.64 | IC2.6 v17.5,40.68 | v21.97,45.4 21.5,45.4 | D1.1 20.61,30.03 U$6.P$1
  Bottom 0.2: v17.42,60.6 17.57,60.6 19.37,58.8 19.7,58.8 20.64,57.86 20.64,55.84 21.5,54.97 21.5,45.4 21.5,36.56 17.57,32.63 17.57,32.2 17.57,31.54 16.83,30.8 15.94,30.8 15.37,30.23 15.37,28.67 17.19,26.86 21.04,26.86 21.88,26.02 21.88,24.68 | 13.85,12.97 17.34,12.97 19.3,14.92 19.3,16.59 20.3,17.6 21.88,19.18 21.88,24.64 | L1.P$1 6.28,60.44
  Bottom 0.203: 17.57,32.2 17.58,32.19 U$6.P$1
  Bottom 1: 13.85,10.96 REG.2
  Bottom 1.5: 13.85,10.96 13.85,12.97 12.13,14.68 | D3.P$1 8.32,14.68 C10.1 12.13,14.68 | 12.13,14.68 12.13,17.59 11.72,18 D4.P$1
  pour Bottom (no thermals): 5.1,64.4 8.1,64.4 8.1,63.6 8.1,63.4 7.5,62.8 7.5,60.2 7.5,57.67 7.13,57.3 5.41,57.3 5.1,57.61
5V_IN
  Bottom 1: D3.P$2 8.57,10.63 10.73,10.63 C15.1 12.11,10.65 C21.1 12.3,8.83 12.77,8.36 M365.3
5V_USB  (via drill 0.3 pad 0.8)
  Top 0.4: USB.1 2.4,34.1 1.76,34.74 v1.7,34.74 | v7.5,20 7.5,21.4 3.5,25.4 1.61,25.4 1.02,25.99 1.02,27.33 v0.9,27.45
  Bottom 0.152: v1.7,34.74 1.76,34.74 2.38,34.12 5.19,34.12 5.66,33.65 5.66,31.23 7.11,29.78 FT231X.P$12
  Bottom 0.4: D4.P$2 7.46,18.96 7.54,18.96 7.5,19 v7.5,20 | v0.9,27.45 2.2,27.45 C22.1 2.12,27.53 C4.1 1.21,29.28 0.63,29.86 0.63,34.02 0.63,34.31 1.06,34.74 v1.7,34.74
42V
  Bottom 0.152: 4.98,10.18 4.98,7.37 M365.6 | 4.98,10.18 4.98,12.43 T1.3 | R12.2 4.98,9.92 4.98,10.18
!DTR1  (via drill 0.3 pad 0.6)
  Top 0.152: PROG.6 0.46,50.5 0.46,31.81 1.37,30.89 1.99,30.89 2.62,30.27 2.62,28.85 3.12,28.34 4.56,28.34 5.37,29.16 7.91,29.16 8.73,28.34 10.12,28.34 10.51,27.95 10.51,27.39 11.39,26.5 11.39,25.84 v11.49,25.74
  Bottom 0.152: FT231X.P$18 10.1,23.16 10.48,23.54 11.3,23.54 11.58,23.54 | 11.58,23.54 11.58,25.65 v11.49,25.74 | 11.58,23.54 12.53,23.54 UMH3N1.2 13.02,23.52 13.67,24.17 UMH3N1.4
!RTS1  (via drill 0.3 pad 0.6)
  Top 0.152: PROG.2 0.76,40.65 0.76,31.94 1.5,31.2 2.12,31.2 2.92,30.4 2.92,28.98 3.23,28.67 4.43,28.67 5.22,29.46 8.04,29.46 8.86,28.64 10.26,28.64 10.81,28.09 10.81,27.52 11.72,26.61 11.72,26.3 v12.57,25.45
  Bottom 0.152: UMH3N1.1 | UMH3N1.1 12.94,22.87 13.58,23.52 UMH3N1.5 14.93,23.52 15.09,23.68 15.09,24.46 14.96,24.6 13.42,24.6 v12.57,25.45 | FT231X.P$19 10.23,22.66 10.44,22.87 UMH3N1.1
!TFTRST  (via drill 0.3 pad 0.6)
  Top 0.152: U$11.P$6 10.8,57.21 11.1,56.91 11.65,56.91 17.29,51.27 v18.43,51.27
  Bottom 0.152: IC3.14 16.18,51.05 16.4,51.27 v18.43,51.27
A2
  Bottom 0.152: ACC.2 3.16,62.94 4.7,61.4 4.7,59.2 4.45,58.95 R2.1 3.99,58.95 3.21,58.17 R25.1
A5
  Bottom 0.152: R1.1 16.08,55.89 16.66,56.47 R24.2 16.66,60.61 18.99,62.94 BRK.2
BACKLIGHT
  Bottom 0.152: R15.1 12.15,61 12.3,60.85 12.3,57 13.14,56.16 14.03,56.16 14.16,56.02 14.16,55.14 14.4,54.9 16.54,54.9 16.76,54.69 16.76,54.66 16.76,53.06 16,52.3 IC3.12
BTN_CENTER  (via drill 0.3 pad 0.6)
  Top 0.152: v15.99,21.77 15.66,22.1 15.66,27.66 14.31,29 12.29,29 11.35,29.95 11.35,39.86 v12.17,40.68
  Bottom 0.152: 12.04,43.47 C27.1 | v15.99,21.77 15.58,21.36 13.1,21.36 13.1,21.35 12.97,21.23 12.97,20.47 12.47,19.97 10.5,19.97 9.7,19.17 9.7,18.4 8.68,17.38 6.15,17.38 5.69,17.38 4.69,17.38 R31.1 4.55,16.64 4.43,16.52 3.33,16.52 3.1,16.29 D7.2 | C27.1 | IC3.29 12.65,44.69 12.04,44.08 C27.1 | v12.17,40.68 11.36,41.49 11.36,42.79 11.55,42.99 11.9,42.99 12.04,43.13 C27.1 | 12.04,43.39 C27.1
BTN_CONTROL  (via drill 0.3 pad 0.6)
  Top 0.152: v12.44,21.43 12.44,21.75 14.7,24.01 14.7,27.72 14.1,28.33 11.3,28.33 11.02,28.33 10.38,28.97 10.38,40.31 10.25,40.44 10.25,40.87 10.79,41.42 10.79,43.91 8.3,46.4 8.3,47 8.3,47.78 v6.77,49.31
  Bottom 0.152: R30.1 4.56,19.66 5.53,20.63 8.07,20.63 8.5,20.2 10.3,20.2 11.1,21 12.01,21 v12.44,21.43 | v6.77,49.31 7.53,48.55 IC3.42
BTN_DOWN  (via drill 0.3 pad 0.6)
  Top 0.152: DOWN.P$1 15.3,16.2 15.36,16.25 15.36,27.53 14.18,28.7 11.09,28.7 10.68,29.11 10.68,40.56 v10.78,40.65
  Bottom 0.152: v10.78,40.65 v10.79,40.65 11.05,40.92 11.05,42.8 10.86,42.99 10.51,42.99 10.38,43.12 C13.2 10.38,43.98 9.65,44.7 IC3.35
BTN_LEFT  (via drill 0.3 pad 0.6)
  Top 0.152: LEFT.P$1 2,26 2.15,25.85 10.63,25.85 11.27,25.21 12,25.21 12.31,24.91 13,24.91 v13.43,25.34 | v12.93,40.65 12.89,40.65 11.65,39.41 11.65,30.08 12.2,29.54 v12.51,29.54
  Bottom 0.152: v12.51,29.54 13.69,28.35 13.69,25.6 v13.43,25.34 | IC3.28 13.15,43.7 C11.1 13.1,43.2 13.3,43 13.57,43 13.77,42.8 13.77,41.5 v12.93,40.65
BTN_RIGHT  (via drill 0.3 pad 0.6)
  Top 0.152: v20.03,42.11 20.05,42.11 21,41.16 21,35.34 18.37,32.71 18.37,31.69 19.72,30.34 19.72,28.38 RIGHT.P$4
  Bottom 0.152: IC3.24 18.45,46.05 18.75,45.75 C12.1 18.96,45.09 18.96,43.18 v20.03,42.11
BTN_UP  (via drill 0.3 pad 0.6)
  Top 0.152: UP.P$4 8.71,35.31 8.71,38.31 9.87,39.48 9.87,40.42 v9.65,40.64
  Bottom 0.152: C14.2 9.4,43.75 9.4,43.82 | C14.2 | C14.2 9.18,43.52 | 9.18,43.52 8.58,42.93 8.58,41.71 v9.65,40.64 | IC3.36 9.15,43.55 9.18,43.52
BUZZER  (via drill 0.3 pad 0.6)
  Top 0.152: v18.62,39.62 19.74,40.74 v19.77,40.74
  Bottom 0.152: v19.77,40.74 20.57,41.53 20.57,43.5 19.77,44.29 19.77,46.02 18.74,47.05 IC3.22 | R32.1 6.76,40.24 7.25,40.73 7.92,40.73 8.39,40.26 8.39,39.56 8.91,39.05 18.05,39.05 v18.62,39.62
DC  (via drill 0.3 pad 0.6)
  Top 0.152: U$11.P$5 10.1,57 10.49,56.61 11.52,56.61 17.39,50.74 v17.89,50.74 v17.9,50.74
  Bottom 0.152: IC3.15 16.29,50.55 16.47,50.73 17.89,50.73 v17.9,50.74
ENABLE  (via drill 0.3 pad 0.6)
  Top 0.152: U$2.P$1 5.3,17.91 7.78,17.91 8.77,18.9 8.77,20.39 8.9,20.53 10.79,20.53 14.4,24.14 14.4,25.51 14.04,25.87 12.9,25.87 11.39,27.38 v11.39,27.69 | v13.14,53.34 11.1,51.3 11.1,41.46 11.38,41.18 11.38,40.48 11,40.1 11,29.38 11.14,29.24 v11.3,29.24
  Bottom 0.152: 12.04,26.6 12.04,24.24 12.11,24.17 UMH3N1.3 | IC3.9 13.15,53.18 13.12,53.22 13.15,53.25 13.19,53.29 | 13.19,53.29 v13.14,53.34 | C18.1 13.48,53.58 13.19,53.29 | R19.2 12.04,26.6 | v11.3,29.24 11.3,27.78 v11.39,27.69 11.39,27.38 12.04,26.73 12.04,26.6
FRONT_LED  (via drill 0.3 pad 0.6)
  Bottom 0.4: LED.1 14.45,70.6 12.87,69.02 C6.1
  other vias: 8.81,67.24 9.73,67.73 9.71,69.82 9.98,71.18 11.48,71.09 11.94,69.62 10.64,70.79 11.75,70.35 8.58,69.69
  pour Bottom (no thermals): 8.3,65.6 8.26,65.64 8.26,66.35 8.26,66.44 7.9,66.8 7.9,70.4 7.9,71.6 9.3,71.6 13.5,71.6 15.12,71.6 15.1,70.24 13.39,68.53 13.39,67.6 10.7,67.6 10.1,67 9.13,67 8.61,66.48 8.61,65.89 8.61,65.6
  pour Top (no thermals): 8.3,65.6 8.26,65.64 8.26,66.35 8.26,66.44 7.9,66.8 7.9,70.4 7.9,71.6 9.3,71.6 13.5,71.6 15.12,71.6 15.1,70.24 13.39,68.53 13.39,67.6 10.7,67.6 10.1,67 9.13,67 8.61,66.48 8.61,65.89 8.61,65.6
GND  (via drill 0.3 pad 0.6)
  Bottom 0.152: R10.1 6.01,14.22 5.27,14.22 T1.1 | BOOST.5 9.46,64.59 9.51,64.64 9.51,64.95 v9.57,65.01 | C15.2 12.09,12.35 C21.2 | FT231X.P$3 FT231X.P$21 FT231X.P$13 | R24.1 15.36,55.75 15.15,55.54 C28.1 | IC2.2 14.81,42.33 14.79,42.31 14.79,41.1
  other vias: 7.9,64.86 10.13,53.8 4.63,54.14 5.24,54.14 5.85,54.14 6.46,54.14 7.07,54.14 7.69,54.15 9.89,54.36 9.53,54.85 9.06,55.23 8.52,55.49 7.94,55.65 7.4,55.97 6.78,55.97 6.18,55.97 5.58,55.97 5.14,56.38 3.98,56.68 4.59,56.66 4.02,54.13 3.41,54.13 19.35,54.85 9.5,16.3 8.44,65.14 8.98,64.86 8.3,54.14 18.34,53.98 13.78,64.12 15.43,64.49 15.94,65.14 22.27,48.47 22.26,46.52 19.84,51.73 5.26,67.52 6.04,67.22 4.7,68.33 5.34,69.94 6.07,69.7 4.89,70.5 5.04,71.25 4.9,69.28 14.88,65.2 15.96,64.08 21.97,56.03 2,37.44 15.83,10.32 18.91,67.31 14.31,66.6 16.9,10.6 14.32,63.77 9.06,53.31 8.84,53.87 13.65,47 11.88,47 10.12,47 10.12,48.75 10.12,50.5 11.88,50.5 13.65,50.5 13.65,48.75 11.88,48.75 7.61,23.16 8.39,22.32 6.78,24 6.01,28.61 1.7,24.59 20.1,24.67 16.19,23.84 5.86,30.09 6.18,15.37 7.79,27.7 3.87,20.87 3.61,50.95 16.99,62.36 21.51,57.15 18.04,56.29 19.84,47.36 20.03,49.28 22.23,30.42 22.29,35.42 22.12,38.41 22.23,41.44 22.25,44.21 22.18,50.53 22.18,52.43 22.23,54.35 12.57,41.32 21.35,17.59 2.74,21.25 1.1,10.2 1.05,11.73 6.25,10.7 9.96,41.35 16.77,44.43 7.33,41.29 17.51,39.61 13.99,39.59 12.31,27.69 17.9,3.9 16.9,37.8 13.7,37.8 21.17,34.12 17.74,29.15 13.35,30.9 14.26,32.65 17.36,53.23 17.89,52.77 17.29,52.48 18.14,55.13 19.33,53.91 19.94,53.16 9.41,29.64 9.62,30.55 7.77,28.42 7.8,27.03 8.47,27.39 8.4,26.55 9.92,25.32 11.02,22.14 14.81,21.95 14.2,21.95 13.59,21.95 1.3,21.2 0.7,18.4 6.34,9.81 12.4,34.82 3.37,56.68
  pour Top (rank 5): -3.5,-2 -3.5,75 15.31,74.93 26.5,75 26.5,-2
  pour Bottom (rank 4, no thermals): 6.1,71.4 7.7,71.4 7.7,68.8 7.7,66.8 8.1,66.4 8.1,65.6 8.3,65.4 8.3,65 8.3,64.8 8.01,64.51 7.21,64.51 4.9,64.51 4.9,71.4
  pour Bottom (rank 5): -3.3,-2 -3.3,75 15.31,74.93 26.5,75 26.5,-2
GPIO0  (via drill 0.3 pad 0.6)
  Top 0.152: v19.8,43.17 19.8,43.06 19.2,42.45 19.2,41.77 19.69,41.28 20.01,41.28 20.39,40.9 20.39,35.59 17.76,32.96 17.76,31.44 19.09,30.11 19.09,25.6 19.09,25.52 | v18.08,24.87 18.44,24.87 19.09,25.52 | 19.09,25.52 19.09,16.7 U$1.P$1
  Bottom 0.152: UMH3N1.6 15,22.86 15.44,23.31 15.44,24.14 15.9,24.6 17.81,24.6 v18.08,24.87 | IC3.23 18.81,46.55 19.45,45.91 19.45,43.52 v19.8,43.17
GPIO35
  Bottom 0.152: IC3.11 14.15,53.37 C28.2 R1.2
GPIO38
  Bottom 0.152: R2.2 4.74,57.65 5.3,57.09 8.21,57.09 C29.2 8.69,56.44 10.66,54.47 10.66,53.27 10.88,53.05 11.96,53.05 12.15,52.86 IC3.7
LED_EN  (via drill 0.3 pad 0.6)
  Top 0.152: 15.71,61.27 v15.71,63.37 15.71,63.08 | v8.96,62.56 10.25,61.27 15.71,61.27 | 15.71,61.27 17.52,61.27 17.95,60.84 17.95,57.45 17.07,56.57 17.07,54.38 18.96,52.49 18.96,49.81 18.54,49.39 v18.52,49.39
  Bottom 0.152: v8.96,62.56 v8.95,62.57 BOOST.6 | v15.71,63.37 v15.7,63.37 R29.2 | v18.52,49.39 18.18,49.05 IC3.18
LED_K  (via drill 0.3 pad 0.6)
  Top 0.152: v14.3,56.87 U$11.P$11
  Bottom 0.152: R13.2 14.33,56.9 v14.3,56.87
LNA_IN
  Bottom 0.23: IC3.2 9.65,53.12 arc90 7.72,55.05 C19.2
M365_DATA  (via drill 0.3 pad 0.6)
  Top 0.152: M365.4 10.23,7.8 13.39,10.96 13.39,13.83 14.86,15.29 17.38,15.29 17.69,15.6 17.69,18.12 18.64,19.08 18.64,23.56 17.55,24.65 17.55,25.09 17.86,25.4 18.54,25.4 18.78,25.65 18.78,29.6 | v19.86,39.42 20.09,39.2 20.09,35.72 17.46,33.09 17.46,31.31 18.78,29.99 18.78,29.6 | 18.78,29.6 18.78,29.62
  Bottom 0.152: IC2.4 18.12,42.98 18.83,42.27 18.83,40.17 18.85,40.15 | 18.85,40.15 19.57,39.42 v19.86,39.42 | J2.1 16.18,40.15 18.85,40.15
M365_DATA_3V3
  Bottom 0.152: IC3.38 7.78,46.55 6.83,45.6 6.83,44.93 5.7,43.8 D5.P$2 7.75,42.1 8.69,41.16 8.69,39.69 | 8.69,39.69 | 8.69,39.69 9.03,39.35 9.85,39.35 10.15,39.65 13.29,39.65 13.9,40.26 14.49,40.26 | 14.49,40.26 14.7,40.26 14.71,40.27 J2.2 | IC2.3 14.88,42.98 14.49,42.59 14.49,40.26
M365_LED_DATA  (via drill 0.3 pad 0.6)
  Top 0.152: v19.7,19.2 19.7,18.76 20.38,18.08 20.38,15.19 20.18,14.99 14.98,14.99 13.7,13.7 13.7,11 15.31,9.39 M365.2
  Bottom 0.152: IC1.4 20.95,21.04 20.71,20.8 19.88,20.8 19.66,20.58 J1.1 19.66,19.24 v19.7,19.2
M365_LED_DATA_3V3  (via drill 0.3 pad 0.6)
  Top 0.152: 20.7,41.03 20.7,41 | v21.26,25.24 21.04,25.24 19.39,26.89 19.39,30 | 20.7,41.03 20.7,41 | 20.7,41.03 20.14,41.58 19.81,41.58 19.5,41.89 19.5,42.33 19.81,42.64 20.1,42.64 20.33,42.87 v20.33,44.49 | 19.39,30 19.39,30.07 | 19.39,30 19.39,30.24 18.07,31.57 18.07,32.84 20.7,35.46 20.7,41
  Bottom 0.152: J1.2 21.12,20.12 21.55,20.55 21.55,22.09 20.95,22.7 IC1.3 20.95,24.93 v21.26,25.24 | IC3.20 20.35,48.05 20.55,47.85 20.55,44.98 20.33,44.76 v20.33,44.49
MOSI  (via drill 0.3 pad 0.6)
  Top 0.152: U$11.P$3 8.7,57.2 9.9,56 11.26,56 17.59,49.68 v17.76,49.68 v17.77,49.67
  Bottom 0.152: v17.77,49.67 17.76,49.68 16.23,49.68 16.11,49.55 IC3.17
N$1
  Bottom 0.152: IC3.41 7.2,48.05 6.37,48.88 R16.1
N$2
  Bottom 0.2: ANT1.1 4.15,55.05 C19.1
N$3  (via drill 0.3 pad 0.6)
  Top 0.152: v21.9,10.4 RED_POWER_LED.1
  Bottom 0.152: R18.2 v21.9,10.4
N$4  (via drill 0.3 pad 0.6)
  Top 0.152: CENTER.P$4 9.5,19.16 7.92,17.58 6.01,17.58 5.87,17.44 v5.87,16.33
  Bottom 0.152: T1.4 3.95,12.65 4.49,13.19 4.49,15.45 D7.1 5.59,15.68 5.87,15.96 v5.87,16.33
N$5
  Bottom 0.152: T1.5 3.32,13.32 2.49,13.32 2.1,12.93 R9.2 2.1,12.42 2.6,11.92 R11.2 | R11.2 2.74,11.22 | R11.2 2.74,11.22 | 2.74,11.22 R12.1
N$6  (via drill 0.3 pad 0.6)
  Top 0.152: v9.95,21.4 8.11,21.4 5.32,24.19 v5.32,25.06
  Bottom 0.152: v9.95,21.4 9.51,21.84 FT231X.P$20 | 6.58,25.09 FT231X.P$11 6.3,25.06 5.99,25.06 | C5.1 5.99,25.06 | FT231X.P$10 5.89,24.16 5.89,25.06 | 5.89,25.06 v5.32,25.06 | 5.89,25.06 5.99,25.06
N$7
  Bottom 0.152: BOOST.7 8.45,62.95 8.1,62.6 L1.P$2
  pour Bottom (no thermals): 8.29,64.37 8.6,64.37 8.61,64.36 8.61,63.63 8.95,63.29 8.95,57.75 7.66,57.75 7.66,62.56 7.7,62.6 8.1,63 8.29,63.19
N$8
  Bottom 0.152: BOOST.4 9.66,65.99 10.1,65.55 10.1,64.99 10.37,64.72 12.33,64.72 12.5,64.89 R5.2
N$9
  Bottom 0.152: BOOST.3 8.95,66.45 9.24,66.74 10.62,66.74 R6.1 | R6.1 12.82,66.94 C6.2 | R6.1 10.82,65.66 R7.2
N$10
  Bottom 0.152: T1.6 2.33,14.15 R9.1
N$11  (via drill 0.3 pad 0.6)
  Top 0.152: v17.5,30.2 17.5,30.84 17.15,31.19 17.15,33.21 17.98,34.04 v17.98,34.71 v17.99,34.71
  Top 0.203: v9.85,34.27 9.79,34.27 8.11,32.59 U$6.P$2
  Bottom 0.152: 8.99,36.05 9.12,36.18 D6.2 9.12,36.19 9.21,36.1 16.08,36.1 16.1,36.1 | 16.1,36.1 17.29,36.1 17.99,35.4 v17.99,34.71 | U$8.P$3 16.55,29.25 v17.5,30.2 17.7,30 D1.2 | 16.1,36.1 16.08,36.08 R21.2 16.08,34.58
  Bottom 0.203: 16.08,34.58 15.62,34.12 12.06,34.12 11.91,34.27 v9.85,34.27
N$12
  Bottom 0.152: T2.3 8.42,36.05 8.78,35.69 13.85,35.69 14.18,35.36 R21.1
N$13
  Bottom 0.152: T3.6 12.95,59.45 R13.1
N$14
  Bottom 0.152: R15.2 10.5,61 R14.2 11.65,61.95 11.88,61.72 13.51,61.72 13.7,61.88 T3.2
N$15
  Bottom 0.152: R17.2 4.67,46.93 D5.P$1
N$17
  Bottom 0.152: R17.1 6.29,47.05 IC3.39
N$28
  Bottom 0.152: T1.2 5.97,13.4 R10.2 6.7,13.14 7.01,13.45 7.01,15.94 6.09,16.86 5.6,16.86 4.9,16.16 4.21,16.16 3.88,15.82 3.88,15.44 3.62,15.18 2.62,15.18 2.37,15.43 2.37,15.99 2.67,16.29 2.67,18.07 2.97,18.37 R30.2
N$29
  Bottom 0.152: 5.27,38.78 5.48,38.78 R20.2 | 5.27,38.78 6.55,38.78 R32.2 | T2.5 5.5,36.8 5.27,37.03 5.27,38.78
NC
  cutout Top: 3.5,56.6 4.1,56.6 4.5,56.6 4.7,56.4 5.3,55.8 6.9,55.8 7.1,55.8 7.19,55.71 7.59,55.71 7.9,55.4 8.3,55.4 8.5,55.2 8.7,55.2 8.9,55 9.3,54.6 9.7,54.2 9.9,54 9.9,53.6 9.9,52.6 9.9,52 9.5,52 9.5,53.2 9.5,53.4 9.3,53.6 9.3,53.8 8.9,54.2 8.7,54.4 8.3,54.4 4.1,54.4 -0.3,54.4 -0.3,56.6
NC1
  cutout Bottom: 3.5,56.6 4.1,56.6 4.5,56.6 4.7,56.4 5.3,55.8 6.9,55.8 7.1,55.8 7.18,55.72 7.58,55.72 7.9,55.4 8.3,55.4 8.5,55.2 8.7,55.2 8.9,55 9.3,54.6 9.7,54.2 9.9,54 9.9,53.6 9.9,52.6 9.9,52 9.5,52 9.5,53.2 9.5,53.4 9.3,53.6 9.3,53.8 8.9,54.2 8.7,54.4 8.3,54.4 4.1,54.4 -0.3,54.4 -0.3,56.6
RX0
  Bottom 0.152: FT231X.P$17 10.13,23.66 11.27,24.8 11.28,24.8 11.28,25.21 10.96,25.52 10.96,26.86 10.64,27.18 10.64,32.84 9.75,33.73 6.6,33.73 4.78,35.55 4.78,36.6 4.3,37.08 4.3,43.74 3.42,44.62 3.42,45.4 | IC3.40 6.94,47.55 6.44,48.05 3.76,48.05 3.42,47.72 3.42,47.68 | 3.42,47.68 2.58,47.68 2.2,47.3 PROG.4 2.2,46.73 2.82,46.12 3.42,45.51 3.42,45.4 | 3.42,47.68 3.42,45.4
SCK  (via drill 0.3 pad 0.6)
  Top 0.152: U$11.P$4 9.4,57.2 10.3,56.3 11.39,56.3 17.48,50.21 18.29,50.21 v18.36,50.14
  Bottom 0.152: IC3.16 16.44,50.05 16.59,50.2 18.3,50.2 v18.36,50.14
SENSOR_VN  (via drill 0.3 pad 0.6)
  Top 0.152: LS1.2 3.87,38.8 3.45,39.22 3.45,49.03 5.62,51.2 9.48,51.2 10.7,52.42 10.7,55.17 v10.4,55.47
  Bottom 0.152: 12.58,54.12 12.65,54.05 | 12.58,52.7 12.65,52.62 IC3.8 12.58,52.38 12.58,53.58 12.58,54.12 | 12.58,54.12 12.5,54.2 C30.1 R28.2 11.36,54.83 11.25,54.94 10.62,54.94 10.4,55.15 v10.4,55.47
TFTCS  (via drill 0.3 pad 0.6)
  Top 0.152: U$11.P$7 11.5,57.5 16.85,52.15 | 17.1,51.9 16.85,52.15 | v17.9,51.8 17.2,51.8 16.85,52.15
  Bottom 0.152: IC3.13 16.07,51.55 16.32,51.8 v17.9,51.8
TX0  (via drill 0.3 pad 0.6)
  Top 0.152: v10.7,21.4 11.22,21.4 12.58,22.76 12.58,24.17 11.86,24.89 10.84,24.89 v10.71,25.02
  Bottom 0.152: 1.04,48.43 1.04,46.69 1.86,45.86 2.37,45.86 3.12,45.11 3.12,44.49 3.96,43.65 3.96,36.99 4.48,36.47 4.48,35.42 6.47,33.43 9.61,33.43 10.34,32.7 10.34,27.01 10.46,26.89 10.46,25.27 v10.71,25.02 | 1.04,48.43 1.04,48.8 PROG.5 2.78,48.88 | v10.7,21.4 10.7,21.07 10.37,20.74 8.75,20.74 8.61,20.88 FT231X.P$1 | R16.2 2.78,48.88 | 1.04,48.43 2.33,48.43 2.78,48.88
USB-DATA_M  (via drill 0.3 pad 0.6)
  Top 0.152: v5.13,33.43 3.47,33.43 USB.2
  Bottom 0.152: v5.13,33.43 5.23,33.34 5.23,26.12 4.7,25.6 4.7,25 4.48,24.78 C3.2 3.58,24.78 3.4,24.6 3.4,23.85 3.25,23.7 R3.1
USB-DATA_P  (via drill 0.3 pad 0.6)
  Top 0.152: v4.7,32.8 USB.3
  Bottom 0.152: v4.7,32.8 4.9,32.6 4.9,28.2 4.9,26.23 4.52,25.85 C2.2 4.05,26.45 3.9,26.6 1.63,26.6 1.14,26.11 1.14,23.12 1.62,22.64 R4.1
USBDM
  Bottom 0.152: FT231X.P$9 4.09,23.66 R3.2
USBDP
  Bottom 0.152: FT231X.P$8 5.03,23.16 4.51,22.64 R4.2
VDD_SDIO  (via drill 0.3 pad 0.6)
  Bottom 0.152: IC3.26 v14.15,44.06

### Text on the board
tPlace: v2.6
bPlace: 42V | GND | DATA | 5V | RGB
bNames: JLCJLCJLCJLC | NC